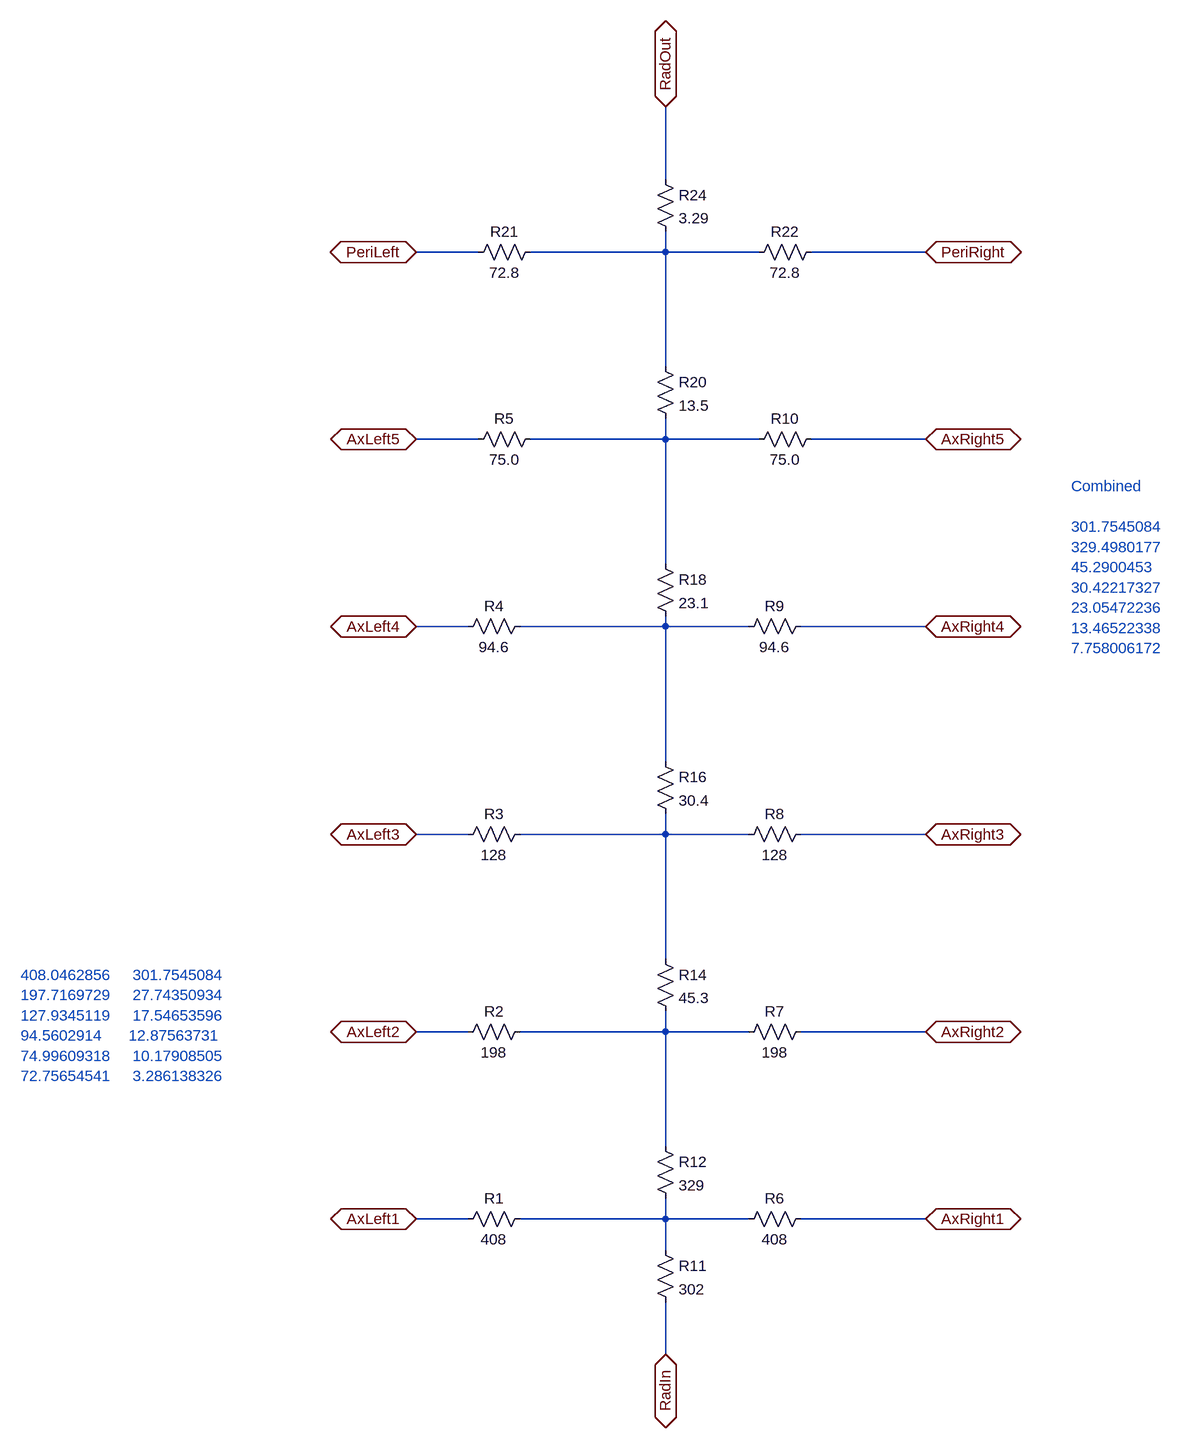
[diagram p0: schematic NearNerveResistance1mm.asc]
NearNerveResistance1mm.asc, the LTspice schematic file:
Version 4
SHEET 1 2076 744
WIRE 528 -1232 528 -1344
WIRE 240 -1120 144 -1120
WIRE 528 -1120 528 -1152
WIRE 528 -1120 320 -1120
WIRE 672 -1120 528 -1120
WIRE 928 -1120 752 -1120
WIRE 528 -944 528 -1120
WIRE 240 -832 144 -832
WIRE 528 -832 528 -864
WIRE 528 -832 320 -832
WIRE 672 -832 528 -832
WIRE 928 -832 752 -832
WIRE 528 -640 528 -832
WIRE 224 -544 144 -544
WIRE 528 -544 528 -560
WIRE 528 -544 304 -544
WIRE 656 -544 528 -544
WIRE 928 -544 736 -544
WIRE 528 -336 528 -544
WIRE 224 -224 144 -224
WIRE 528 -224 528 -256
WIRE 528 -224 304 -224
WIRE 656 -224 528 -224
WIRE 928 -224 736 -224
WIRE 528 -32 528 -224
WIRE 224 80 144 80
WIRE 528 80 528 48
WIRE 528 80 304 80
WIRE 656 80 528 80
WIRE 928 80 736 80
WIRE 528 256 528 80
WIRE 224 368 144 368
WIRE 528 368 528 336
WIRE 528 368 304 368
WIRE 656 368 528 368
WIRE 928 368 736 368
WIRE 528 416 528 368
WIRE 528 576 528 496
FLAG 528 576 RadIn
IOPIN 528 576 BiDir
FLAG 528 -1344 RadOut
IOPIN 528 -1344 BiDir
FLAG 928 368 AxRight1
IOPIN 928 368 BiDir
FLAG 928 80 AxRight2
IOPIN 928 80 BiDir
FLAG 928 -224 AxRight3
IOPIN 928 -224 BiDir
FLAG 928 -544 AxRight4
IOPIN 928 -544 BiDir
FLAG 928 -832 AxRight5
IOPIN 928 -832 BiDir
FLAG 928 -1120 PeriRight
IOPIN 928 -1120 BiDir
FLAG 144 368 AxLeft1
IOPIN 144 368 BiDir
FLAG 144 80 AxLeft2
IOPIN 144 80 BiDir
FLAG 144 -224 AxLeft3
IOPIN 144 -224 BiDir
FLAG 144 -544 AxLeft4
IOPIN 144 -544 BiDir
FLAG 144 -832 AxLeft5
IOPIN 144 -832 BiDir
FLAG 144 -1120 PeriLeft
IOPIN 144 -1120 BiDir
SYMBOL res 752 352 R90
WINDOW 0 0 56 VBottom 0
WINDOW 3 32 56 VTop 0
SYMATTR InstName R6
SYMATTR Value 408
SYMBOL res 752 64 R90
WINDOW 0 0 56 VBottom 0
WINDOW 3 32 56 VTop 0
SYMATTR InstName R7
SYMATTR Value 198
SYMBOL res 752 -240 R90
WINDOW 0 0 56 VBottom 0
WINDOW 3 32 56 VTop 0
SYMATTR InstName R8
SYMATTR Value 128
SYMBOL res 752 -560 R90
WINDOW 0 0 56 VBottom 0
WINDOW 3 32 56 VTop 0
SYMATTR InstName R9
SYMATTR Value 94.6
SYMBOL res 768 -848 R90
WINDOW 0 0 56 VBottom 0
WINDOW 3 32 56 VTop 0
SYMATTR InstName R10
SYMATTR Value 75.0
SYMBOL res 512 400 R0
SYMATTR InstName R11
SYMATTR Value 302
SYMBOL res 512 240 R0
SYMATTR InstName R12
SYMATTR Value 329
SYMBOL res 512 -48 R0
SYMATTR InstName R14
SYMATTR Value 45.3
SYMBOL res 512 -352 R0
SYMATTR InstName R16
SYMATTR Value 30.4
SYMBOL res 512 -656 R0
SYMATTR InstName R18
SYMATTR Value 23.1
SYMBOL res 512 -960 R0
SYMATTR InstName R20
SYMATTR Value 13.5
SYMBOL res 768 -1136 R90
WINDOW 0 0 56 VBottom 0
WINDOW 3 32 56 VTop 0
SYMATTR InstName R22
SYMATTR Value 72.8
SYMBOL res 512 -1248 R0
SYMATTR InstName R24
SYMATTR Value 3.29
SYMBOL res 320 352 R90
WINDOW 0 0 56 VBottom 0
WINDOW 3 32 56 VTop 0
SYMATTR InstName R1
SYMATTR Value 408
SYMBOL res 320 64 R90
WINDOW 0 0 56 VBottom 0
WINDOW 3 32 56 VTop 0
SYMATTR InstName R2
SYMATTR Value 198
SYMBOL res 320 -240 R90
WINDOW 0 0 56 VBottom 0
WINDOW 3 32 56 VTop 0
SYMATTR InstName R3
SYMATTR Value 128
SYMBOL res 320 -560 R90
WINDOW 0 0 56 VBottom 0
WINDOW 3 32 56 VTop 0
SYMATTR InstName R4
SYMATTR Value 94.6
SYMBOL res 336 -848 R90
WINDOW 0 0 56 VBottom 0
WINDOW 3 32 56 VTop 0
SYMATTR InstName R5
SYMATTR Value 75.0
SYMBOL res 336 -1136 R90
WINDOW 0 0 56 VBottom 0
WINDOW 3 32 56 VTop 0
SYMATTR InstName R21
SYMATTR Value 72.8
TEXT -464 -8 Left 0 ;408.0462856     301.7545084\n197.7169729     27.74350934\n127.9345119     17.54653596\n94.5602914      12.87563731\n74.99609318     10.17908505\n72.75654541     3.286138326
TEXT 1152 -760 Left 0 ;Combined\n \n301.7545084\n329.4980177\n45.2900453\n30.42217327\n23.05472236\n13.46522338\n7.758006172

The netlist it stands for:
* NearNerveResistance1mm.asc
R6 AxRight1 N006 408
R7 AxRight2 N005 198
R8 AxRight3 N004 128
R9 AxRight4 N003 94.6
R10 AxRight5 N002 75.0
R11 N006 RadIn 302
R12 N005 N006 329
R14 N004 N005 45.3
R16 N003 N004 30.4
R18 N002 N003 23.1
R20 N001 N002 13.5
R22 PeriRight N001 72.8
R24 RadOut N001 3.29
R1 N006 AxLeft1 408
R2 N005 AxLeft2 198
R3 N004 AxLeft3 128
R4 N003 AxLeft4 94.6
R5 N002 AxLeft5 75.0
R21 N001 PeriLeft 72.8
* 408.0462856     301.7545084
* 197.7169729     27.74350934
* 127.9345119     17.54653596
* 94.5602914      12.87563731
* 74.99609318     10.17908505
* 72.75654541     3.286138326
* Combined
* 301.7545084
* 329.4980177
* 45.2900453
* 30.42217327
* 23.05472236
* 13.46522338
* 7.758006172
.backanno
.end